# EAGLE schematic power-supply-board (EAGLE 7.5.0)
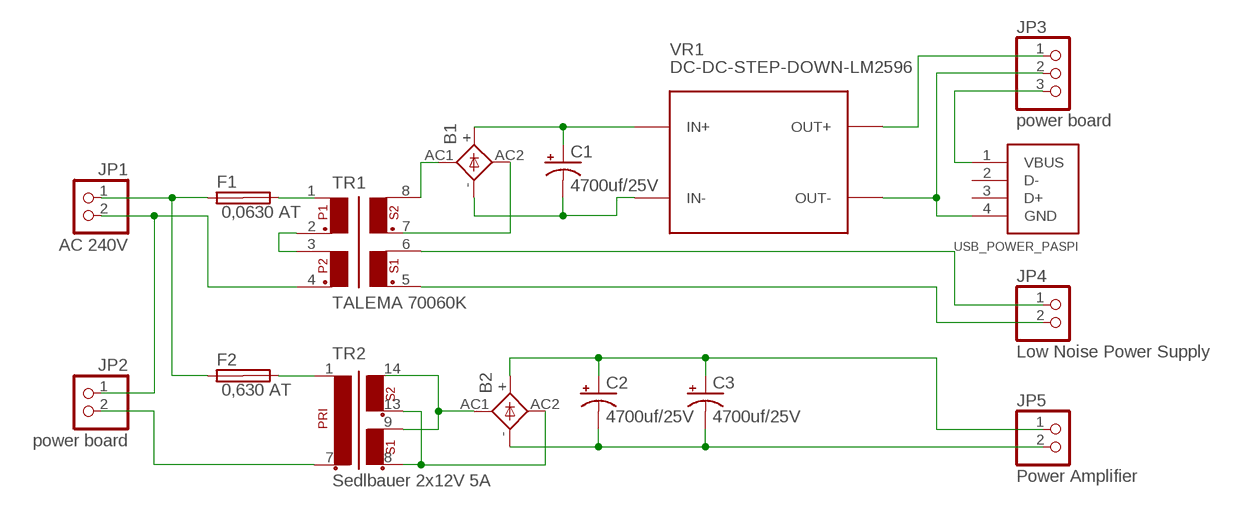
[diagram p0: schematic, sheet 1]

## Parts
B1  KBU  [KBU]
B2  KBU  [KBU]
C1  4700uf/25V  1000UF-25V(PTH)KIT  [CPOL-RADIAL-1000UF-25V-KIT]
C2  4700uf/25V  1000UF-25V(PTH)KIT  [CPOL-RADIAL-1000UF-25V-KIT]
C3  4700uf/25V  1000UF-25V(PTH)KIT  [CPOL-RADIAL-1000UF-25V-KIT]
F1  0,0630 AT  SHK20L  [SHK20L]
F2  0,630 AT  SHK20L  [SHK20L]
JP1  AC 240V  PINHD-1X2  [1X02]
JP2  power board  PINHD-1X2  [1X02]
JP3  power board  PINHD-1X3  [1X03]
JP4  Low Noise Power Supply  PINHD-1X2  [1X02]
JP5  Power Amplifier  PINHD-1X2  [1X02]
TR1  TALEMA 70060K  FL10  [FL10-30]
TR2  Sedlbauer 2x12V 5A  BV054-5387.0K  [EI54-18,8_16VA]
USB_POWER_PASPI  USB POWER RASPI  USB-CON-4PIN  [USB-MALE-A-PCB]
VR1  DC-DC-STEP-DOWN-LM2596  [DC-DC-STEP-DOWN-LM2596]

## Nets
N$1: F1.2A
N$2: F2.2A TR2.1
N$3: TR1.2 TR1.3
N$4: B2.AC2 TR2.8 TR2.13
N$5: B2.AC1 TR2.9
N$6: B1.AC1 TR1.8
N$7: B1.AC2
N$8: B1.+ C1.+ VR1.IN+
N$9: B1.- C1.- VR1.IN-
N$10: JP3.1 VR1.OUT+
N$11: JP4.1 TR1.6
N$12: JP4.2 TR1.5
N$13: JP3.2 USB_POWER_PASPI.4(GND) VR1.OUT-
N$14: F1.1A F2.1A JP1.1
N$15: JP3.3 USB_POWER_PASPI.1(VBUS)
N$17: JP1.2 JP2.1 TR1.4
N$18: B2.+ C2.+ C3.+ JP5.1
N$19: B2.- C2.- C3.- JP5.2
N$20: JP2.2 TR2.7
Unconnected: F1.1B F1.2B F2.1B F2.2B TR1.1 TR1.7 TR2.14 USB_POWER_PASPI.2(D-) USB_POWER_PASPI.3(D+)

## Library data of the parts
B1 B2 = rectifier:KBU: DIOTEC RECTIFIER
C1-C3 = SparkFun-Capacitors:1000UF-25V(PTH): CAP-08070; PROD_ID: CAP-09538; VALUE: 1000uf/25V
F1 F2 = fuse:SHK20L: FUSE HOLDER 5 x 20 mm, SH contact, SHH1 Schukat, E1073 Buerklin; OC_FARNELL: unknown; OC_NEWARK: unknown
JP1 JP2 JP4 JP5 = pinhead:PINHD-1X2: PIN HEADER
JP3 = pinhead:PINHD-1X3: PIN HEADER
TR1 = trafo:FL10: TRANSFORMER 2 primary winding, 2 secondary windings, mounting holes BLOCK
TR2 = trafo:BV054-*: ERA EI 54/18,8 16 VA Source: 207-5567.pdf
USB_POWER_PASPI = GeekAmmo:USB-CON-4PIN: USB Connector 4 Pin - No SHIELD
VR1 = diy-modules:DC-DC-STEP-DOWN-LM2596: DC/DC Step-Down Regulator based on LM2596-ADJ chip